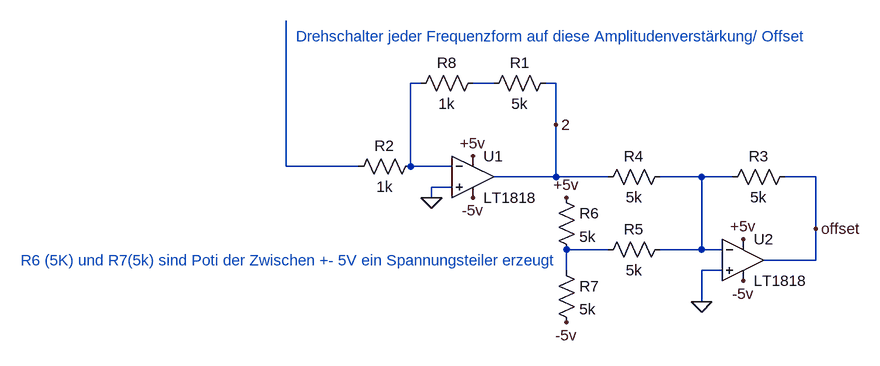
[diagram p0: schematic Amplitudenverstaerkung_offset.asc]
Amplitudenverstaerkung_offset.asc, the LTspice schematic file:
Version 4.1
SHEET 1 880 680
WIRE 32 0 16 0
WIRE 144 0 112 0
WIRE 240 0 224 0
WIRE 240 64 240 0
WIRE -176 128 -176 -96
WIRE -64 128 -176 128
WIRE 16 128 16 0
WIRE 80 128 16 128
WIRE 240 144 240 64
WIRE 240 144 144 144
WIRE 320 144 240 144
WIRE 464 144 400 144
WIRE 512 144 464 144
WIRE 640 144 592 144
WIRE 80 160 48 160
WIRE 48 176 48 160
WIRE 640 224 640 144
WIRE 320 256 256 256
WIRE 464 256 464 144
WIRE 464 256 400 256
WIRE 496 256 464 256
WIRE 640 272 640 224
WIRE 640 272 560 272
WIRE 256 288 256 256
WIRE 496 288 464 288
WIRE 464 336 464 288
FLAG 112 176 -5v
FLAG 112 112 +5v
FLAG 48 176 0
FLAG 240 64 2
FLAG 528 304 -5v
FLAG 528 240 +5v
FLAG 464 336 0
FLAG 256 176 +5v
FLAG 256 368 -5v
FLAG 640 224 offset
SYMBOL OpAmps\\LT1818 112 144 R0
SYMATTR InstName U1
SYMBOL res 240 -16 R90
WINDOW 0 0 56 VBottom 2
WINDOW 3 32 56 VTop 2
SYMATTR InstName R1
SYMATTR Value 5k
SYMBOL res 32 112 R90
WINDOW 0 0 56 VBottom 2
WINDOW 3 32 56 VTop 2
SYMATTR InstName R2
SYMATTR Value 1k
SYMBOL OpAmps\\LT1818 528 272 R0
SYMATTR InstName U2
SYMBOL res 608 128 R90
WINDOW 0 0 56 VBottom 2
WINDOW 3 32 56 VTop 2
SYMATTR InstName R3
SYMATTR Value 5k
SYMBOL res 416 128 R90
WINDOW 0 0 56 VBottom 2
WINDOW 3 32 56 VTop 2
SYMATTR InstName R4
SYMATTR Value 5k
SYMBOL res 304 272 R270
WINDOW 0 32 56 VTop 2
WINDOW 3 0 56 VBottom 2
SYMATTR InstName R5
SYMATTR Value 5k
SYMBOL res 240 160 R0
SYMATTR InstName R6
SYMATTR Value 5k
SYMBOL res 240 272 R0
SYMATTR InstName R7
SYMATTR Value 5k
SYMBOL res 128 -16 R90
WINDOW 0 0 56 VBottom 2
WINDOW 3 32 56 VTop 2
SYMATTR InstName R8
SYMATTR Value 1k
TEXT -584 272 Left 2 ;R6 (5K) und R7(5k) sind Poti der Zwischen +- 5V ein Spannungsteiler erzeugt
TEXT -160 -72 Left 2 ;Drehschalter jeder Frequenzform auf diese Amplitudenverstärkung/ Offset

The netlist it stands for:
* Amplitudenverstaerkung_offset.asc
X§U1 0 N001 2 +5v -5v LT1818  ; pins In+ In- OUT V+ V-
R1 2 N002 5k
R2 N001 N003 1k
X§U2 0 N004 offset +5v -5v LT1818  ; pins In+ In- OUT V+ V-
R3 offset N004 5k
R4 N004 2 5k
R5 N005 N004 5k
R6 +5v N005 5k
R7 N005 -5v 5k
R8 N002 N001 1k
* R6 (5K) und R7(5k) sind Poti der Zwischen +- 5V ein Spannungsteiler erzeugt
* Drehschalter jeder Frequenzform auf diese Amplitudenverstärkung/ Offset
.lib LTC2.lib
.backanno
.end